# Altium project FPGA_ADC_SHIELD_PCB.PrjPcb
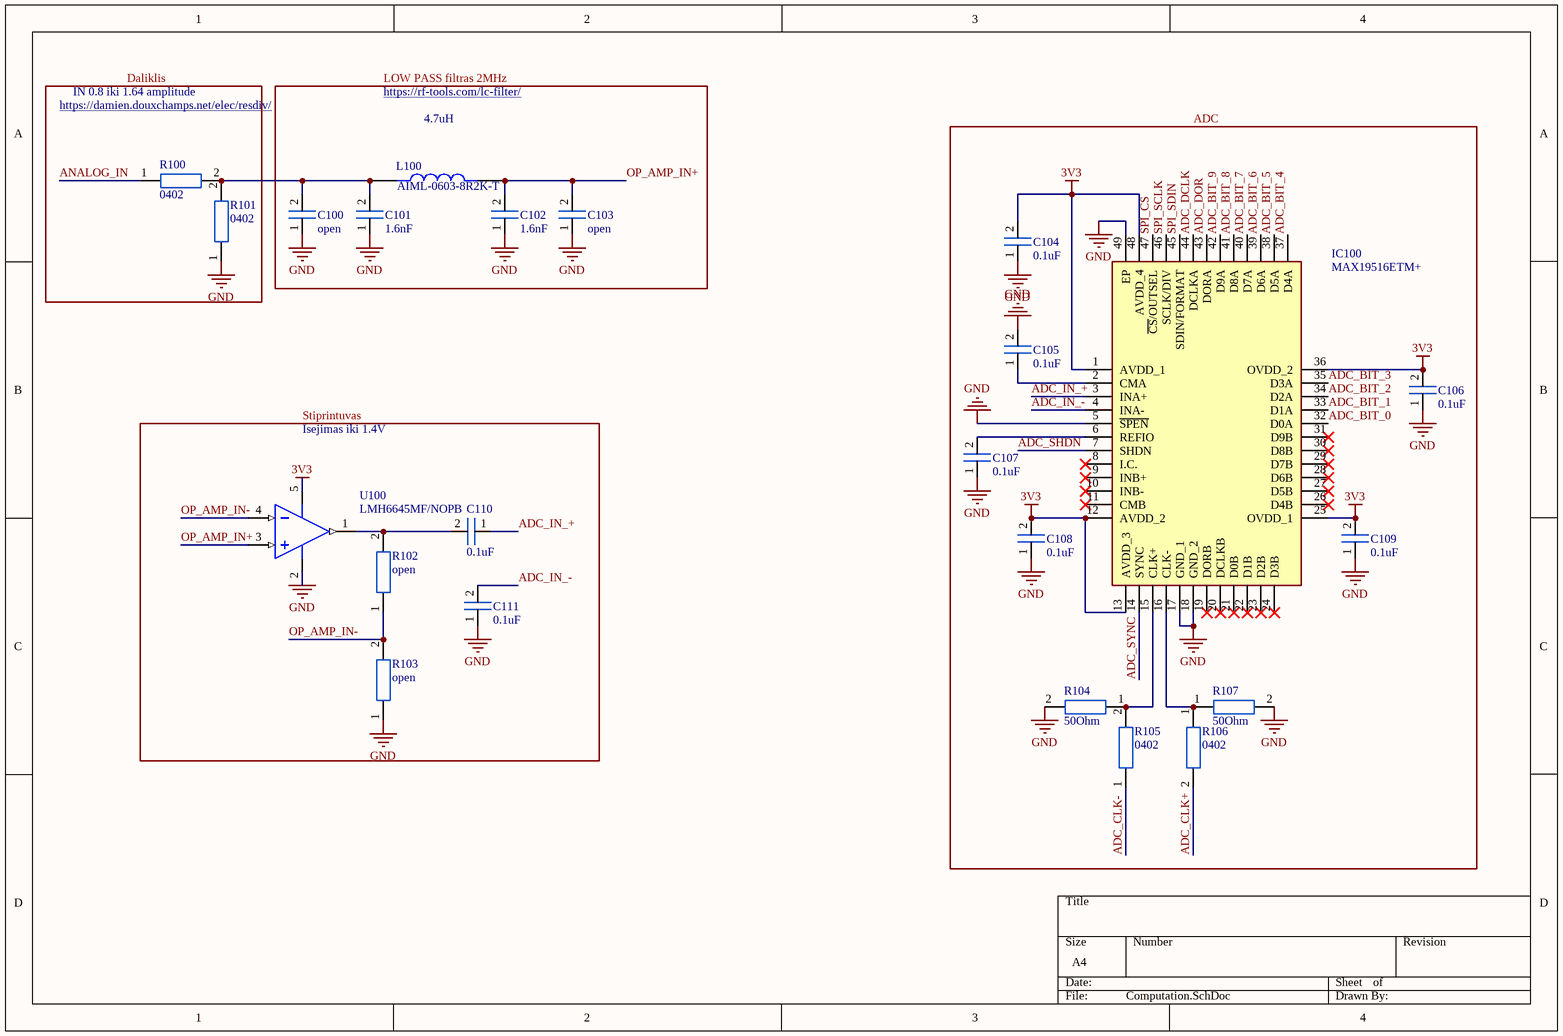
[diagram p0: Computation.SchDoc]
2 sheets, 27 parts. Net scope: global (net labels, ports and power ports of the same name join across sheets).
Board file: MainBoard.PcbDoc
Sheets:
  Computation.SchDoc
  Connectors.SchDoc

## Sheet Computation.SchDoc
size A4; SheetNumber: 1; SheetTotal: 2

### Parts
C100  open  [0402_footprint]
C101  1.6nF  [0402_footprint]
C102  1.6nF  [0402_footprint]
C103  open  [0402_footprint]
C104  0.1uF  [0402_footprint]
C105  0.1uF  [0402_footprint]
C106  0.1uF  [0402_footprint]
C107  0.1uF  [0402_footprint]
C108  0.1uF  [0402_footprint]
C109  0.1uF  [0402_footprint]
C110  0.1uF  [0402_footprint]
C111  0.1uF  [0402_footprint]
IC100  MAX19516ETM+  [QFN50P700X700X80-49N]
L100  AIML-0603-8R2K-T  [INDC1608X95N]
R100  0402  [0402_footprint]
R101  0402  [0402_footprint]
R102  open  [0402_footprint]
R103  open  [0402_footprint]
R104  50Ohm  [0402_footprint]
R105  0402  [0402_footprint]
R106  0402  [0402_footprint]
R107  50Ohm  [0402_footprint]
U100  LMH6645MF/NOPB  [DBV0005A_N]

### Blocks framed on the sheet
ADC: C104-C109 IC100 R104-R107

### Nets
3V3: C104.2 C106.2 C108.2 C109.2 IC100.1(AVDD_1) IC100.12(AVDD_2) IC100.13(AVDD_3) IC100.25(OVDD_1) IC100.36(OVDD_2) IC100.48(AVDD_4) U100.5(V+)
GND: C100.1 C101.1 C102.1 C103.1 C104.1 C105.2 C106.1 C107.1 C108.1 C109.1 C111.1 IC100.5(~{SPEN}) IC100.17(GND_1) IC100.18(GND_2) IC100.49(EP) R101.1 R103.1 R104.2 R107.2 U100.2(V-)
ADC_BIT_0: IC100.32(D0A)
ADC_BIT_1: IC100.33(D1A)
ADC_BIT_2: IC100.34(D2A)
ADC_BIT_3: IC100.35(D3A)
ADC_BIT_4: IC100.37(D4A)
ADC_BIT_5: IC100.38(D5A)
ADC_BIT_6: IC100.39(D6A)
ADC_BIT_7: IC100.40(D7A)
ADC_BIT_8: IC100.41(D8A)
ADC_BIT_9: IC100.42(D9A)
ADC_CLK+: R106.2
ADC_CLK-: R105.1
ADC_DCLK: IC100.44(DCLKA)
ADC_DOR: IC100.43(DORA)
ADC_IN_+: C110.1 IC100.3(INA+)
ADC_IN_-: C111.2 IC100.4(INA-)
ADC_SHDN: IC100.7(SHDN)
ADC_SYNC: IC100.14(SYNC)
ANALOG_IN: R100.1
OP_AMP_IN+: C102.2 C103.2 L100.2 U100.3(IN+)
OP_AMP_IN-: R102.1 R103.2 U100.4(IN-)
SPI_CS: IC100.47(~{CS}/OUTSEL)
SPI_SCLK: IC100.46(SCLK/DIV)
SPI_SDIN: IC100.45(SDIN/FORMAT)
NetC100_2: C100.2 C101.2 L100.1 R100.2 R101.2
NetC105_1: C105.1 IC100.2(CMA)
NetC107_2: C107.2 IC100.6(REFIO)
NetC110_2: C110.2 R102.2 U100.1(OUT)
NetIC100_15: IC100.15(CLK+) R104.1 R105.2
NetIC100_16: IC100.16(CLK-) R106.1 R107.1

Not connected (* = marked no-connect by the designer): IC100 8(I.C.)* 9(INB+)* 10(INB-)* 11(CMB)* 19(DORB)* 20(DCLKB)* 21(D0B)* 22(D1B)* 23(D2B)* 24(D3B)* 26(D4B)* 27(D5B)* 28(D6B)* 29(D7B)* 30(D8B)* 31(D9B)*

### Notes on the sheet
- https://damien.douxchamps.net/elec/resdiv/
- IN 0.8 iki 1.64 amplitude
- Daliklis
- LOW PASS filtras 2MHz
- https://rf-tools.com/lc-filter/
- 4.7uH
- Isejimas iki 1.4V
- Stiprintuvas

### Library data of the parts
C100-C111 = Capacitor_0402: 0402 capacitor
IC100 = MAX19516ETM+: Integrated Circuit; Manufacturer_Name: Maxim Integrated; Datasheet Link: https://datasheets.maximintegrated.com/en/ds/MAX19516.pdf; Height: 0.8mm; Manufacturer_Part_Number: MAX19516ETM+; Mouser Part Number: 700-MAX19516ETM; Mouser Price/Stock: https://www.mouser.co.uk/ProductDetail/Maxim-Integrated/MAX19516ETM%2b/?qs=1THa7WoU59FJ2JI%2FsSE3dA%3D%3D
L100 = AIML-0603-8R2K-T: 8.2 ÂµH Shielded Multilayer Inductor 4 mA 2.1Ohm Max 0603 (1608 Metric); MF: Abracon; Purchase-URL: https://pricing.snapeda.com/search/part/AIML-0603-8R2K-T/?ref=eda; Package: 1608 Taiyo Yuden; MP: AIML-0603-8R2K-T; Price: None; Availability: In Stock; Value: *; Check_prices: https://www.snapeda.com/parts/AIML-0603-8R2K-T/Abracon/view-part/?ref=eda; SnapEDA_Link: https://www.snapeda.com/parts/AIML-0603-8R2K-T/Abracon/view-part/?ref=snap
R100-R107 = Resistor_0402
U100 = CMP-0055-01245-3: 2.7V, 650uA, 65MHz, Rail-to-Rail Input and Output Amplifiers with Shutdown Option, 5-pin SOT-23, Pb-Free; Manufacturer: Texas Instruments; PowerWise: Y; PackageTopMarking: A68A*XTT; Package Reference: DBV0005A; PackageDescription: Molded SOT-23, .115 x .063 x .040 in Body, 5 Lead, .0375 in Pitch; ComponentLink1URL: http://www.ti.com/general/docs/lit/getliterature.tsp?genericPartNumber=LMH6645&fileType=pdf; CompType: Amplifiers; PinCount: 5; RoHS: Y; ComponentLink1Description: Datasheet URL

## Sheet Connectors.SchDoc
size A4; SheetNumber: 2; SheetTotal: 2
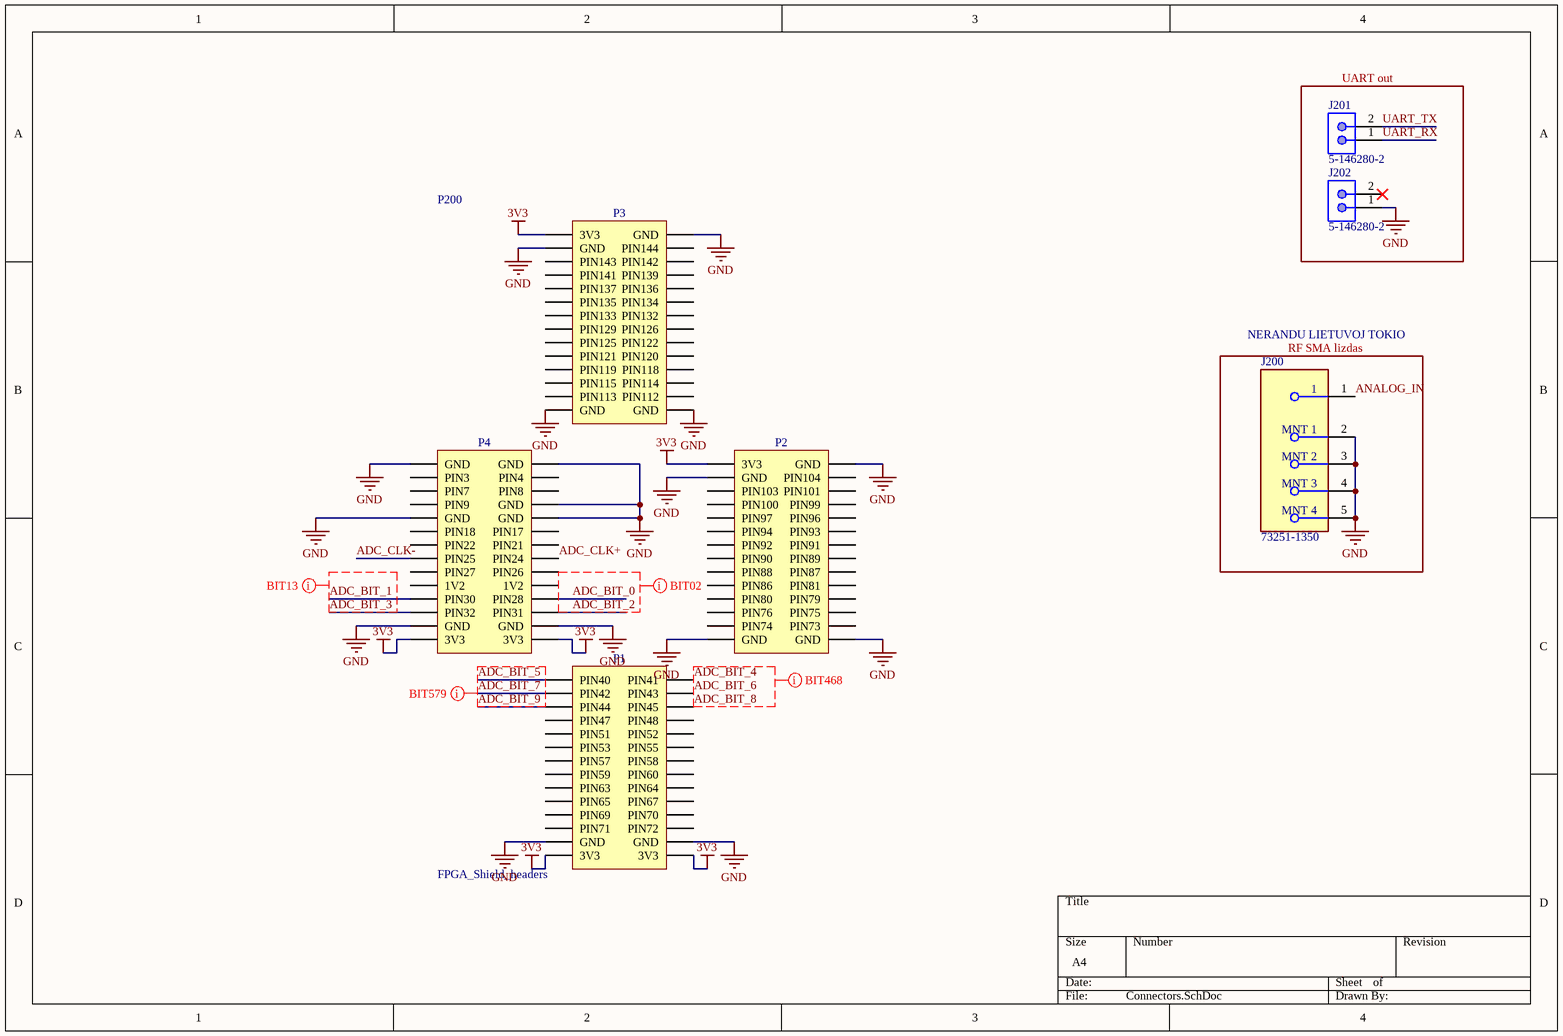
[diagram p1: Connectors.SchDoc]

### Parts
J200  73251-1350  [FP-73251-1350-MFG]
J201  5-146280-2  [TECO-5-146280-2_V]
J202  5-146280-2  [TECO-5-146280-2_V]
P200  FPGA_Shield_headers  [FPGA_SHIELD_HEADER_FOOTPRINT]

### Blocks framed on the sheet
UART out: J201 J202

### Nets
3V3: P200.27(3V3) P200.28(3V3) P200.29(3V3) P200.57(3V3) P200.111(3V3) P200.112(3V3)
GND: J200.2(MNT_1) J200.3(MNT_2) J200.4(MNT_3) J200.5(MNT_4) J202.1 P200.1(GND) P200.2(GND) P200.8(GND) P200.9(GND) P200.10(GND) P200.25(GND) P200.26(GND) P200.30(GND) P200.31(GND) P200.55(GND) P200.56(GND) P200.58(GND) P200.59(GND) P200.83(GND) P200.84(GND) P200.109(GND) P200.110(GND)
ADC_BIT_0: P200.22(PIN28)
ADC_BIT_1: P200.21(PIN30)
ADC_BIT_2: P200.24(PIN31)
ADC_BIT_3: P200.23(PIN32)
ADC_BIT_4: P200.86(PIN41)
ADC_BIT_5: P200.85(PIN40)
ADC_BIT_6: P200.88(PIN43)
ADC_BIT_7: P200.87(PIN42)
ADC_BIT_8: P200.90(PIN45)
ADC_BIT_9: P200.89(PIN44)
ADC_CLK+: P200.16(PIN24)
ADC_CLK-: P200.15(PIN25)
ANALOG_IN: J200.1
UART_RX: J201.1
UART_TX: J201.2

Not connected (* = marked no-connect by the designer): J202 2*; P200 3(PIN3) 4(PIN4) 5(PIN7) 6(PIN8) 7(PIN9) 11(PIN18) 12(PIN17) 13(PIN22) 14(PIN21) 17(PIN27) 18(PIN26) 19(1V2) 20(1V2) 32(PIN144) 33(PIN143) 34(PIN142) 35(PIN141) 36(PIN139) 37(PIN137) 38(PIN136) 39(PIN135) 40(PIN134) 41(PIN133) 42(PIN132) 43(PIN129) 44(PIN126) 45(PIN125) 46(PIN122) 47(PIN121) 48(PIN120) 49(PIN119) 50(PIN118) 51(PIN115) 52(PIN114) 53(PIN113) 54(PIN112) 60(PIN104) 61(PIN103) 62(PIN101) 63(PIN100) 64(PIN99) 65(PIN97) 66(PIN96) 67(PIN94) 68(PIN93) 69(PIN92) 70(PIN91) 71(PIN90) 72(PIN89) 73(PIN88) 74(PIN87) 75(PIN86) 76(PIN81) 77(PIN80) 78(PIN79) 79(PIN76) 80(PIN75) 81(PIN74) 82(PIN73) 91(PIN47) 92(PIN48) 93(PIN51) 94(PIN52) 95(PIN53) 96(PIN55) 97(PIN57) 98(PIN58) 99(PIN59) 100(PIN60) 101(PIN63) 102(PIN64) 103(PIN65) 104(PIN67) 105(PIN69) 106(PIN70) 107(PIN71) 108(PIN72)

### Layout directives
net class BIT468: ADC_BIT_4, ADC_BIT_6, ADC_BIT_8
net class BIT579: ADC_BIT_7
net class BIT13: ADC_BIT_1, ADC_BIT_3
net class BIT02: ADC_BIT_0, ADC_BIT_2

### Notes on the sheet
- NERANDU LIETUVOJ TOKIO
- (near J200) RF SMA lizdas

### Library data of the parts
J200 = CMP-04764-000006-1: CONN SMA JACK STR 50 OHM SMD; Manufacturer: Molex; Is Female: yes; Standoff Height: 0.41mm; Impedance: 50Ω; Number Of Contacts: 1; Conn Orientation: Straight; Voltage Rating: 500V; Shielding: true; Frequency: 18GHz; Package: 73251-1350; Device Class L1: Connectors; Category: Conn; Manufacturer Part Number: 73251-1350; ComponentLink2URL: https://www.molex.com/pdm_docs/sd/732511350_sd.pdf; Automotive: No; Height: 9.655mm; Octopart: https://octopart.com/73251-1350-molex-5414390; Footprint Url: https://forum.upverter.com/uploads/default/original/3X/d/a/daeafa2ce4908d4fc4e49f0b17d7d2c986fce444.pdf; Temperature Range High: +165°C; Device Class L3: unset; Mouser Description: RF Connectors / Coaxial Connectors SMA ST PCB-JCK STD SMT; Lead Free: Yes; Temperature: -65°C to +165°C; RoHS: TRUE; ComponentLink2Description: Datasheet; Device Class L2: RF / Coaxial Connectors; Digikey Description: CONN SMA JACK STR 50 OHM SMD; Contact Material: Gold; Temperature Range Low: -65°C
J201 J202 = CMP-2000-07492-1: Male Header, Pitch 2.54 mm, 1 x 2 Position, Height 8.21 mm, Tail Length 3.05 mm, -65 to 105 degC, RoHS, Bulk; Manufacturer: TE Connectivity; Mating Connector Lock: No(Without); Number of Positions: 2; Pitch: 2.54mm; PCB Mounting Orientation: Vertical; Keyed: No; Case\/Package: 100; Mating Post Length: 0.23inch; High Temperature Housing: Yes; Max Current Rating: 5A; PCB Thickness: 0.063inch; PCB Mount Retention: Without; Approvals: CSA; Current Rating: 3A; Radiation Hardening: No; Length: 4.67mm; Contact Mating Length: 0.23inch; Connector Type: Header; Number of Rows: 1; Termination Post Length: 0.12inch; Board Standoff: No(Without); Max Operating Temperature: 105degC; Contact Shape: Square; Selectively Loaded: No(Without); Gasket: No(Without); Number of Contacts: 2; Contact Gender: Male; Mating Alignment: No(Without); Manufacturer URL: http://www.te.com/; Datasheet URL: http://www.te.com/commerce/DocumentDelivery/DDEController?Action=showdoc&DocId=Customer+Drawing%7F146280%7FH1%7Fpdf%7FEnglish%7FENG_CD_146280_H1.pdf%7F5-146280-2; Mount: ThroughHole; Orientation: Straight; Packaging: Carton; Package Reference: 5-146280-2; Package Quantity: 500; Stabilizers: No(Without); Row Spacing: 2.54mm; Contact Material: CopperAlloy; Panel Mount Retention: No(Without); Datasheet Version: Rev. H1, 08/2016; Housing Colour: Black; Colour: Black; Package Description: Male Header, Pitch 2.54 mm, 1 x 2 Position, Height 8.21 mm, Tail Length 3.05 mm; Contact Plating: Matte; Housing Material: Polymer; Contact Protection: No(Without); Min Operating Temperature: -65degC; Mounting Technology: ThroughHole; Flammability Rating: UL94V-0; RoHSCompliant: true; Termination: ThroughHole; Depth: 2.34mm; High Speed Serial Data Connector: No

## Nets that join several sheets
3V3: Computation (11 pins), Connectors (6 pins)
GND: Computation (20 pins), Connectors (22 pins)
ADC_BIT_0: Computation (IC100.32), Connectors (P200.22)
ADC_BIT_1: Computation (IC100.33), Connectors (P200.21)
ADC_BIT_2: Computation (IC100.34), Connectors (P200.24)
ADC_BIT_3: Computation (IC100.35), Connectors (P200.23)
ADC_BIT_4: Computation (IC100.37), Connectors (P200.86)
ADC_BIT_5: Computation (IC100.38), Connectors (P200.85)
ADC_BIT_6: Computation (IC100.39), Connectors (P200.88)
ADC_BIT_7: Computation (IC100.40), Connectors (P200.87)
ADC_BIT_8: Computation (IC100.41), Connectors (P200.90)
ADC_BIT_9: Computation (IC100.42), Connectors (P200.89)
ADC_CLK+: Computation (R106.2), Connectors (P200.16)
ADC_CLK-: Computation (R105.1), Connectors (P200.15)
ANALOG_IN: Computation (R100.1), Connectors (J200.1)